# EAGLE schematic reclone-rise (EAGLE 7.6.0)

## Sheet 1 of 2: MCU, Power, uSD, USB, JTAG, Serial, RTC
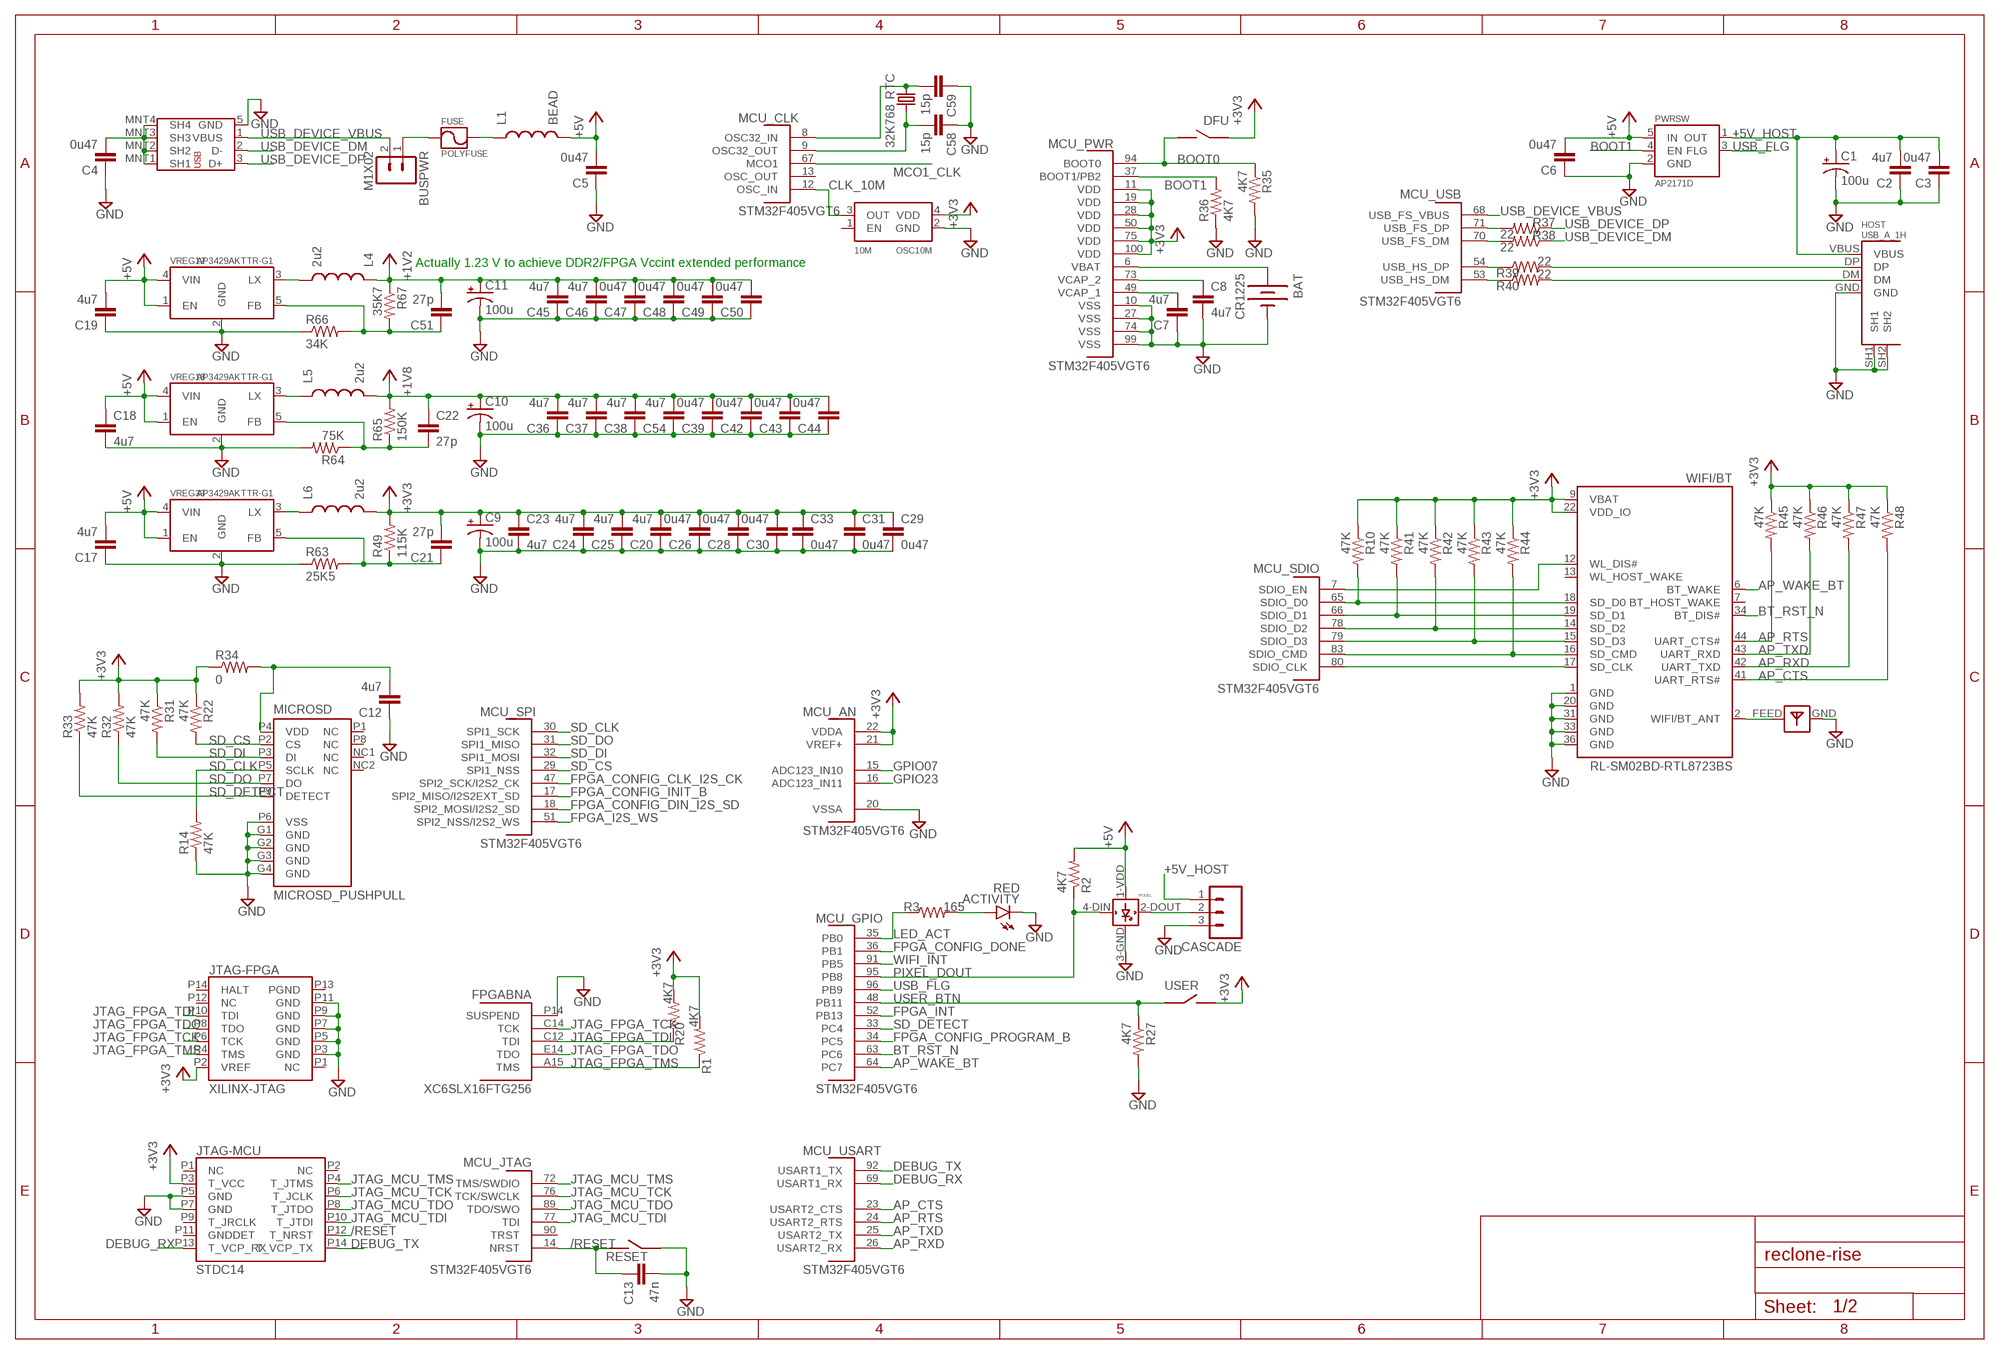
[diagram p0: schematic, sheet 1]

### Parts
ACTIVITY  RED  LED0603  [LED-0603]
ANTENNA  ANTENNA_MEANDER_2.4GHZ  [MEANDER_ANTENNA_2.4GHZ]
BAT  CR1225  BATTERY12MM  [BATTCON_12MM]
BUSPWR  M1X02  [1X2-RTANG]
C1  100u  CAP_POL1206  [EIA3216]
C2  4u7  CAP0603-CAP  [0603-CAP]
C3  0u47  CAP0603-CAP  [0603-CAP]
C4  0u47  CAP0603-CAP  [0603-CAP]
C5  0u47  CAP0603-CAP  [0603-CAP]
C6  0u47  CAP0603-CAP  [0603-CAP]
C7  4u7  CAP0603-CAP  [0603-CAP]
C8  4u7  CAP0603-CAP  [0603-CAP]
C9  100u  CAP_POL1206  [EIA3216]
C10  100u  CAP_POL1206  [EIA3216]
C11  100u  CAP_POL1206  [EIA3216]
C12  4u7  CAP0603-CAP  [0603-CAP]
C13  47n  CAP0603-CAP  [0603-CAP]
C17  4u7  CAP0603-CAP  [0603-CAP]
C18  4u7  CAP0603-CAP  [0603-CAP]
C19  4u7  CAP0603-CAP  [0603-CAP]
C20  4u7  CAP0603-CAP  [0603-CAP]
C21  27p  CAP0603-CAP  [0603-CAP]
C22  27p  CAP0603-CAP  [0603-CAP]
C23  4u7  CAP0603-CAP  [0603-CAP]
C24  4u7  CAP0603-CAP  [0603-CAP]
C25  4u7  CAP0603-CAP  [0603-CAP]
C26  0u47  CAP0603-CAP  [0603-CAP]
C28  0u47  CAP0603-CAP  [0603-CAP]
C29  0u47  CAP0603-CAP  [0603-CAP]
C30  0u47  CAP0603-CAP  [0603-CAP]
C31  0u47  CAP0603-CAP  [0603-CAP]
C33  0u47  CAP0603-CAP  [0603-CAP]
C36  4u7  CAP0603-CAP  [0603-CAP]
C37  4u7  CAP0603-CAP  [0603-CAP]
C38  4u7  CAP0603-CAP  [0603-CAP]
C39  0u47  CAP0603-CAP  [0603-CAP]
C42  0u47  CAP0603-CAP  [0603-CAP]
C43  0u47  CAP0603-CAP  [0603-CAP]
C44  0u47  CAP0603-CAP  [0603-CAP]
C45  4u7  CAP0603-CAP  [0603-CAP]
C46  4u7  CAP0603-CAP  [0603-CAP]
C47  0u47  CAP0603-CAP  [0603-CAP]
C48  0u47  CAP0603-CAP  [0603-CAP]
C49  0u47  CAP0603-CAP  [0603-CAP]
C50  0u47  CAP0603-CAP  [0603-CAP]
C51  27p  CAP0603-CAP  [0603-CAP]
C54  4u7  CAP0603-CAP  [0603-CAP]
C58  15p  CAP0603-CAP  [0603-CAP]
C59  15p  CAP0603-CAP  [0603-CAP]
CASCADE  M03PTH  [1X03]
DEVICE  USB-MICRO-B-SMD  [USB-MICRO-B-SMD]
DFU  PTS636  [PB_TACT_PTH_6X3.5]
FPGA  XC6SLX16FTG256  [FT256]
FUSE  POLYFUSE  [1206L]
HOST  USB_A_1H  [USB-A-1H]
JTAG-FPGA  XILINX-JTAG  [XILINX-JTAG]
JTAG-MCU  STDC14  [PTH_14_1.27]
L1  BEAD  INDUCTOR0603  [0603]
L4  2u2  INDUCTOR0805  [0805]
L5  2u2  INDUCTOR0805  [0805]
L6  2u2  INDUCTOR0805  [0805]
MCU  STM32F405VGT6  [LQFP-100]
MICROSD  MICROSD_PUSHPULL  [MICROSD_PUSHPULL]
OSC10M  10M  OSC_ENABLED_SMD  [OSC-5X3.2]
PIXEL  WS2812B  [WS2812B]
PWRSW  AP2171D  [SOT25]
R1  4K7  RESISTOR0603-RES  [0603-RES]
R2  4K7  RESISTOR0603-RES  [0603-RES]
R3  165  RESISTOR0603-RES  [0603-RES]
R10  47K  RESISTOR0603-RES  [0603-RES]
R14  47K  RESISTOR0603-RES  [0603-RES]
R20  4K7  RESISTOR0603-RES  [0603-RES]
R22  47K  RESISTOR0603-RES  [0603-RES]
R27  4K7  RESISTOR0603-RES  [0603-RES]
R31  47K  RESISTOR0603-RES  [0603-RES]
R32  47K  RESISTOR0603-RES  [0603-RES]
R33  47K  RESISTOR0603-RES  [0603-RES]
R34  0  RESISTOR0603-RES  [0603-RES]
R35  4K7  RESISTOR0603-RES  [0603-RES]
R36  4K7  RESISTOR0603-RES  [0603-RES]
R37  22  RESISTOR0603-RES  [0603-RES]
R38  22  RESISTOR0603-RES  [0603-RES]
R39  22  RESISTOR0603-RES  [0603-RES]
R40  22  RESISTOR0603-RES  [0603-RES]
R41  47K  RESISTOR0603-RES  [0603-RES]
R42  47K  RESISTOR0603-RES  [0603-RES]
R43  47K  RESISTOR0603-RES  [0603-RES]
R44  47K  RESISTOR0603-RES  [0603-RES]
R45  47K  RESISTOR0603-RES  [0603-RES]
R46  47K  RESISTOR0603-RES  [0603-RES]
R47  47K  RESISTOR0603-RES  [0603-RES]
R48  47K  RESISTOR0603-RES  [0603-RES]
R49  115K  RESISTOR0603-RES  [0603-RES]
R63  25K5  RESISTOR0603-RES  [0603-RES]
R64  75K  RESISTOR0603-RES  [0603-RES]
R65  150K  RESISTOR0603-RES  [0603-RES]
R66  34K  RESISTOR0603-RES  [0603-RES]
R67  35K7  RESISTOR0603-RES  [0603-RES]
RESET  PTS636  [PB_TACT_PTH_6X3.5]
RTC  32K768  CRYSTAL  [CRYSTAL-32KHZ-SMD]
USER  SPST_TACT_6X6  [PB_TACT_PTH_6X6]
VREG12  AP3429AKTTR-G1  AP3429A  [SOT-23-5]
VREG18  AP3429AKTTR-G1  AP3429A  [SOT-23-5]
VREG33  AP3429AKTTR-G1  AP3429A  [SOT-23-5]
WIFI/BT  RL-SM02BD-RTL8723BS  [LGA12-44]

### Nets
+1V2: C11.A(+) C45.2 C46.2 C47.2 C48.2 C49.2 C50.2 C51.2 L4.1 R67.1 ; also sheet 2
+1V8: C10.A(+) C22.1 C36.2 C37.2 C38.2 C39.2 C42.2 C43.2 C44.2 C54.2 L5.2 R65.2 ; also sheet 2
+3V3: C9.A(+) C20.2 C21.2 C23.1 C24.2 C25.2 C26.2 C28.2 C29.1 C30.2 C31.1 C33.1 DFU.1(A) JTAG-FPGA.P2(VREF) JTAG-MCU.P3(T_VCC) L6.2 MCU.11(_PWR:VDD) MCU.19(_PWR:VDD) MCU.21(_AN:VREF+) MCU.22(_AN:VDDA) MCU.28(_PWR:VDD) MCU.50(_PWR:VDD) MCU.75(_PWR:VDD) MCU.100(_PWR:VDD) OSC10M.4(VDD) R1.2 R10.1 R20.2 R22.1 R31.1 R32.2 R33.2 R34.1 R41.1 R42.1 R43.1 R44.1 R45.1 R46.1 R47.1 R48.1 R49.2 USER.3(B) WIFI/BT.9(VBAT) WIFI/BT.22(VDD_IO) ; also sheet 2
+3V3_SD: C12.2 MICROSD.P4(VDD) R34.2
+5V: C5.2 C6.2 C17.2 C18.1 C19.2 L1.2 PIXEL.1-VDD(VDD) PWRSW.5(IN) R2.2 VREG12.1(EN) VREG12.4(VIN) VREG18.1(EN) VREG18.4(VIN) VREG33.1(EN) VREG33.4(VIN) ; also sheet 2
+5V_HOST: C1.A(+) C2.2 C3.2 CASCADE.1 HOST.VBUS PWRSW.1(OUT)
/RESET: C13.1 JTAG-MCU.P12(T_NRST) MCU.14(_JTAG:NRST) RESET.2(B)
ANTENNA: ANTENNA.FEED WIFI/BT.2(WIFI/BT_ANT)
AP_CTS: MCU.23(_USART:USART2_CTS) R48.2 WIFI/BT.41(UART_RTS#)
AP_RTS: MCU.24(_USART:USART2_RTS) R45.2 WIFI/BT.44(UART_CTS#)
AP_RXD: MCU.26(_USART:USART2_RX) R47.2 WIFI/BT.42(UART_TXD)
AP_TXD: MCU.25(_USART:USART2_TX) R46.2 WIFI/BT.43(UART_RXD)
AP_WAKE_BT: MCU.64(_GPIO:PC7) WIFI/BT.6(BT_WAKE)
BOOT0: DFU.2(B) MCU.94(_PWR:BOOT0) R35.1
BOOT1: MCU.37(_PWR:BOOT1/PB2) PWRSW.4(EN) R36.2
BT_RST_N: MCU.63(_GPIO:PC6) WIFI/BT.34(BT_DIS#)
CASCADE_DOUT: CASCADE.2 PIXEL.2-DOUT(DOUT)
CLK_10M: MCU.12(_CLK:OSC_IN) OSC10M.3(OUT) ; also sheet 2
DEBUG_RX: JTAG-MCU.P13(T_VCP_RX) MCU.69(_USART:USART1_RX)
DEBUG_TX: JTAG-MCU.P14(T_VCP_TX) MCU.92(_USART:USART1_TX)
DM2: HOST.DM R40.2
DP2: HOST.DP R39.2
FPGA_CONFIG_CLK_I2S_CK: MCU.47(_SPI:SPI2_SCK/I2S2_CK) ; also sheet 2
FPGA_CONFIG_DIN_I2S_SD: MCU.18(_SPI:SPI2_MOSI/I2S2_SD) ; also sheet 2
FPGA_CONFIG_DONE: MCU.36(_GPIO:PB1) ; also sheet 2
FPGA_CONFIG_INIT_B: MCU.17(_SPI:SPI2_MISO/I2S2EXT_SD) ; also sheet 2
FPGA_CONFIG_PROGRAM_B: MCU.34(_GPIO:PC5) ; also sheet 2
FPGA_I2S_WS: MCU.51(_SPI:SPI2_NSS/I2S2_WS) ; also sheet 2
FPGA_INT: MCU.52(_GPIO:PB13) ; also sheet 2
GND: ACTIVITY.C ANTENNA.GND BAT.GND(-) C1.C(-) C2.1 C3.1 C4.1 C5.1 C6.1 C7.1 C8.2 C9.C(-) C10.C(-) C11.C(-) C12.1 C13.2 C17.1 C18.2 C19.1 C20.1 C23.2 C24.1 C25.1 C26.1 C28.1 C29.2 C30.1 C31.2 C33.2 C36.1 C37.1 C38.1 C39.1 C42.1 C43.1 C44.1 C45.1 C46.1 C47.1 C48.1 C49.1 C50.1 C54.1 C58.1 C59.1 CASCADE.3 DEVICE.5(GND) FPGA.P14(BNA:SUSPEND) HOST.GND HOST.SH1 HOST.SH2 JTAG-FPGA.P3(GND) JTAG-FPGA.P5(GND) JTAG-FPGA.P7(GND) JTAG-FPGA.P9(GND) JTAG-FPGA.P11(GND) JTAG-MCU.P5(GND) JTAG-MCU.P7(GND) MCU.10(_PWR:VSS) MCU.20(_AN:VSSA) MCU.27(_PWR:VSS) MCU.74(_PWR:VSS) MCU.99(_PWR:VSS) MICROSD.G1(GND) MICROSD.G2(GND) MICROSD.G3(GND) MICROSD.G4(GND) MICROSD.P6(VSS) OSC10M.2(GND) PIXEL.3-GND(GND) PWRSW.2(GND) R14.1 R27.2 R35.2 R36.1 R63.1 R64.2 R66.1 RESET.1(A) VREG12.2(GND) VREG18.2(GND) VREG33.2(GND) WIFI/BT.1(GND) WIFI/BT.20(GND) WIFI/BT.31(GND) WIFI/BT.33(GND) WIFI/BT.36(GND) ; also sheet 2
GPIO07: MCU.15(_AN:ADC123_IN10) ; also sheet 2
GPIO23: MCU.16(_AN:ADC123_IN11) ; also sheet 2
JTAG_FPGA_TCK: FPGA.C14(BNA:TCK) JTAG-FPGA.P6(TCK)
JTAG_FPGA_TDI: FPGA.C12(BNA:TDI) JTAG-FPGA.P10(TDI) R20.1
JTAG_FPGA_TDO: FPGA.E14(BNA:TDO) JTAG-FPGA.P8(TDO)
JTAG_FPGA_TMS: FPGA.A15(BNA:TMS) JTAG-FPGA.P4(TMS) R1.1
JTAG_MCU_TCK: JTAG-MCU.P6(T_JCLK) MCU.76(_JTAG:TCK/SWCLK)
JTAG_MCU_TDI: JTAG-MCU.P10(T_JTDI) MCU.77(_JTAG:TDI)
JTAG_MCU_TDO: JTAG-MCU.P8(T_JTDO) MCU.89(_JTAG:TDO/SWO)
JTAG_MCU_TMS: JTAG-MCU.P4(T_JTMS) MCU.72(_JTAG:TMS/SWDIO)
LED_ACT: MCU.35(_GPIO:PB0) R3.1
MCO1_CLK: MCU.67(_CLK:MCO1) ; also sheet 2
N$1: MCU.71(_USB:USB_FS_DP) R37.2
N$2: MCU.70(_USB:USB_FS_DM) R38.2
N$3: MCU.54(_USB:USB_HS_DP) R39.1
N$4: MCU.53(_USB:USB_HS_DM) R40.1
N$5: L4.2 VREG12.3(LX)
N$8: C4.2 DEVICE.MNT1(SH1) DEVICE.MNT2(SH2) DEVICE.MNT3(SH3) DEVICE.MNT4(SH4)
N$14: C22.2 R64.1 R65.1 VREG18.5(FB)
N$15: C51.1 R66.2 R67.2 VREG12.5(FB)
N$24: C21.1 R49.1 R63.2 VREG33.5(FB)
N$40: C58.2 MCU.9(_CLK:OSC32_OUT) RTC.4
N$48: C59.2 MCU.8(_CLK:OSC32_IN) RTC.1
N$59: BUSPWR.1 FUSE.1
N$60: ACTIVITY.A R3.2
N$76: FUSE.2 L1.1
N$120: L5.1 VREG18.3(LX)
N$121: L6.1 VREG33.3(LX)
PIXEL_DOUT: MCU.95(_GPIO:PB8) PIXEL.4-DIN(DIN) R2.1
SD_CLK: MCU.30(_SPI:SPI1_SCK) MICROSD.P5(SCLK) R14.2
SD_CS: MCU.29(_SPI:SPI1_NSS) MICROSD.P2(CS) R22.2
SD_DETECT: MCU.33(_GPIO:PC4) MICROSD.P9(DETECT) R33.1
SD_DI: MCU.32(_SPI:SPI1_MOSI) MICROSD.P3(DI) R31.2
SD_DO: MCU.31(_SPI:SPI1_MISO) MICROSD.P7(DO) R32.1
SDIO_CLK: MCU.80(_SDIO:SDIO_CLK) WIFI/BT.17(SD_CLK)
SDIO_CMD: MCU.83(_SDIO:SDIO_CMD) R44.2 WIFI/BT.16(SD_CMD)
SDIO_D0: MCU.65(_SDIO:SDIO_D0) R10.2 WIFI/BT.18(SD_D0)
SDIO_D1: MCU.66(_SDIO:SDIO_D1) R41.2 WIFI/BT.19(SD_D1)
SDIO_D2: MCU.78(_SDIO:SDIO_D2) R42.2 WIFI/BT.14(SD_D2)
SDIO_D3: MCU.79(_SDIO:SDIO_D3) R43.2 WIFI/BT.15(SD_D3)
SDIO_EN: MCU.7(_SDIO:SDIO_EN) WIFI/BT.12(WL_DIS#)
USB_DEVICE_DM: DEVICE.2(D-) R38.1
USB_DEVICE_DP: DEVICE.3(D+) R37.1
USB_DEVICE_VBUS: BUSPWR.2 DEVICE.1(VBUS) MCU.68(_USB:USB_FS_VBUS)
USB_FLG: MCU.96(_GPIO:PB9) PWRSW.3(FLG)
USER_BTN: MCU.48(_GPIO:PB11) R27.1 USER.1(A)
VBAT: BAT.PWR@1(+) MCU.6(_PWR:VBAT)
VCAP_1: C7.2 MCU.49(_PWR:VCAP_1)
VCAP_2: C8.1 MCU.73(_PWR:VCAP_2)
WIFI_INT: MCU.91(_GPIO:PB5)
Unconnected: JTAG-FPGA.P1(NC) JTAG-FPGA.P12(NC) JTAG-FPGA.P13(PGND) JTAG-FPGA.P14(HALT) JTAG-MCU.P1(NC) JTAG-MCU.P2(NC) JTAG-MCU.P9(T_JRCLK) JTAG-MCU.P11(GNDDET) MCU.13(_CLK:OSC_OUT) MCU.90(_JTAG:TRST) MICROSD.NC1(NC) MICROSD.NC2(NC) MICROSD.P1(NC) MICROSD.P8(NC) OSC10M.1(EN) WIFI/BT.7(BT_HOST_WAKE) WIFI/BT.13(WL_HOST_WAKE)

### Notes on the sheet
- Actually 1.23 V to achieve DDR2/FPGA Vccint extended performance

## Sheet 2 of 2: FPGA, GPIO, DDR2, Audio, Video
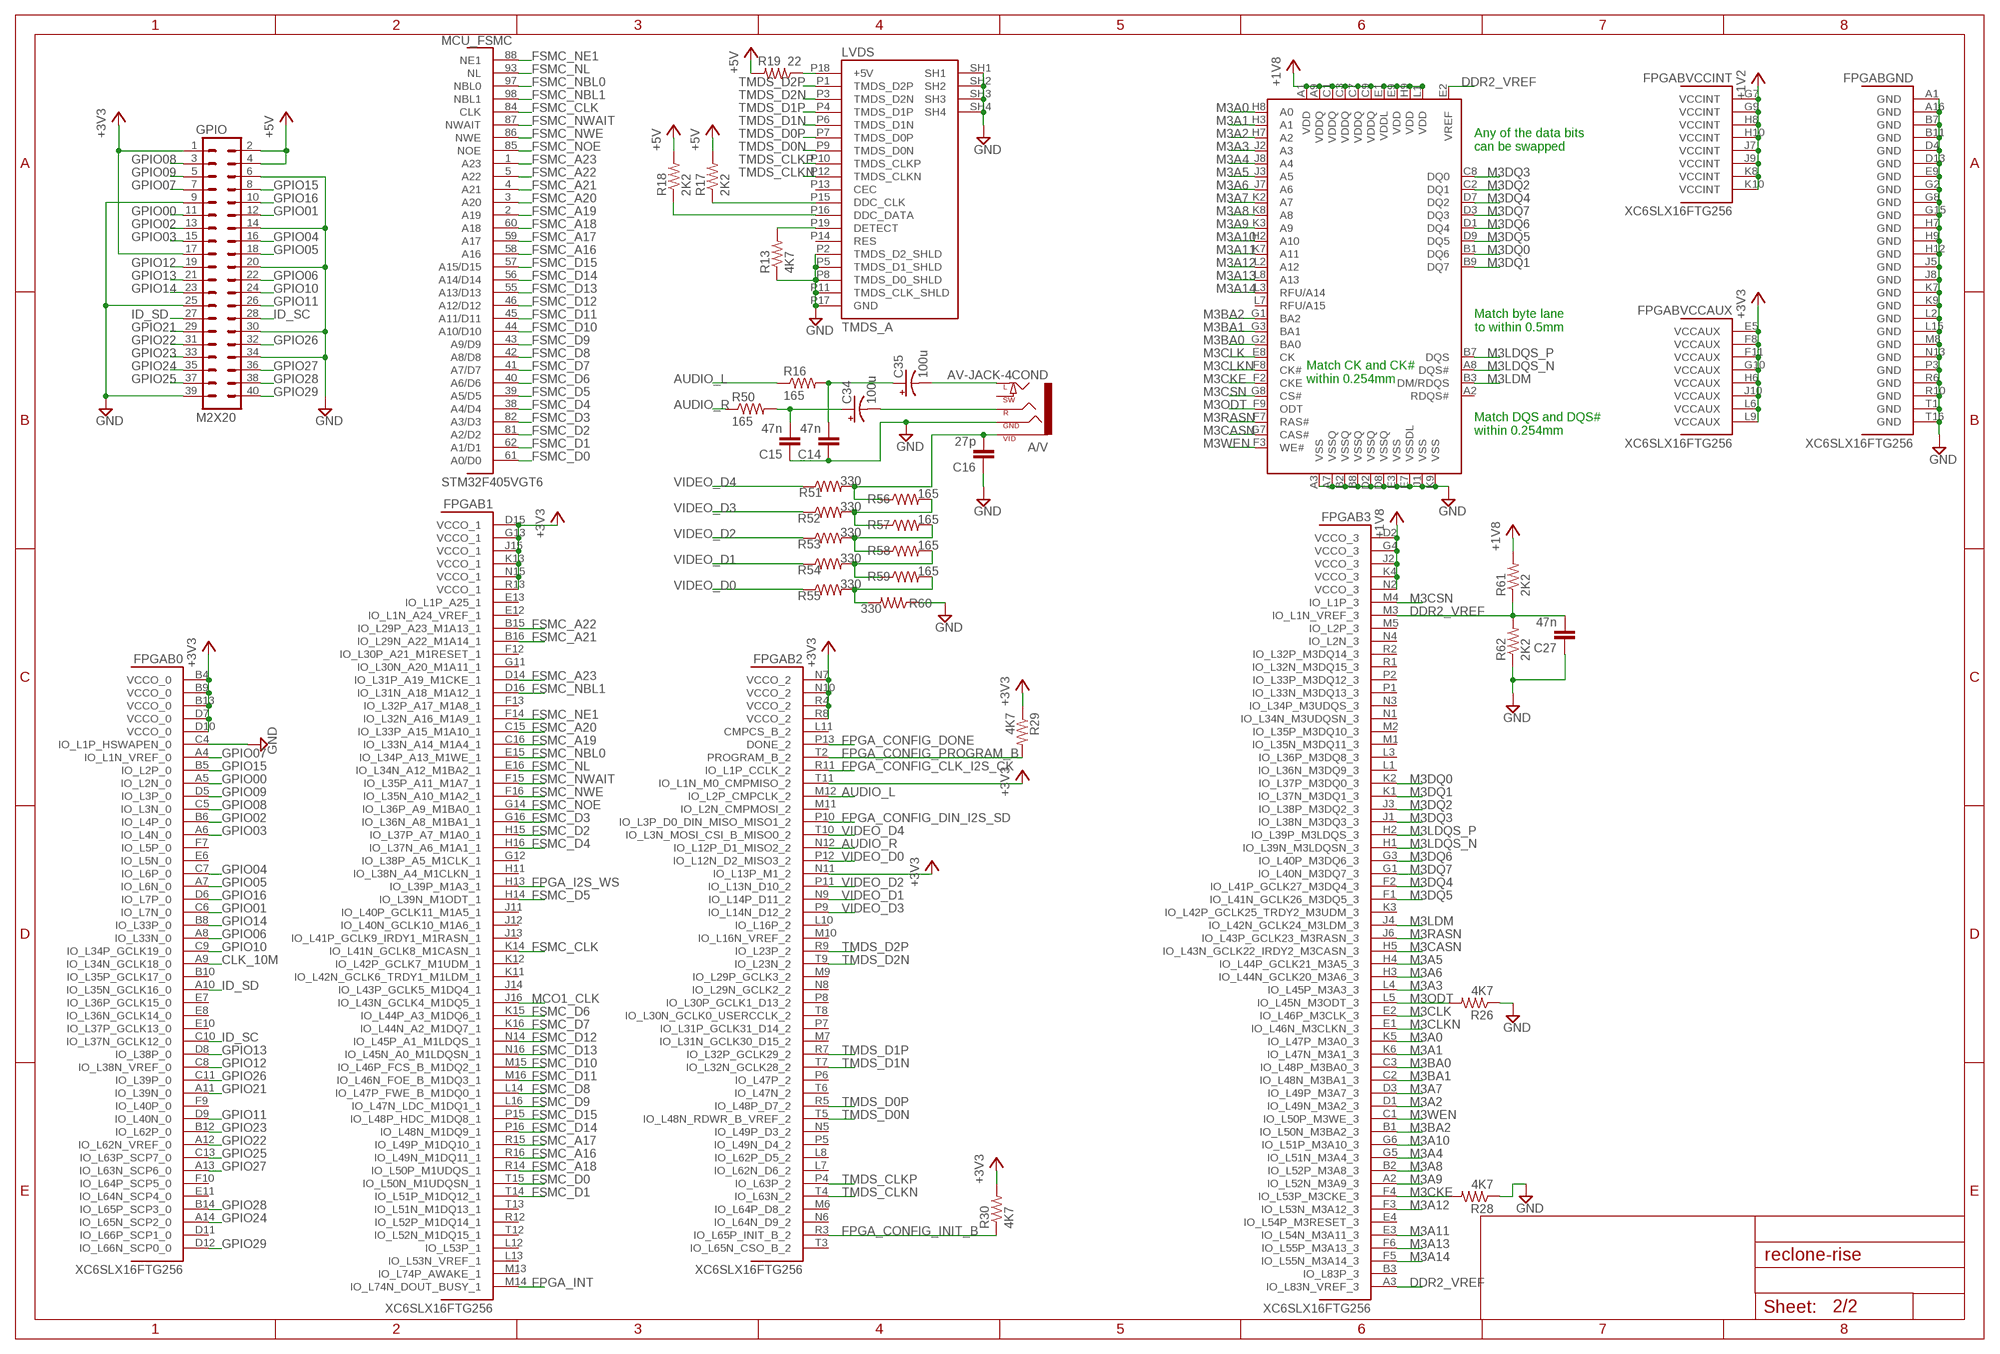
[diagram p1: schematic, sheet 2]

### Parts
A/V  AV-JACK-4COND  [AV-JACK-3.5MM-4COND-SMD]
C14  47n  CAP0603-CAP  [0603-CAP]
C15  47n  CAP0603-CAP  [0603-CAP]
C16  27p  CAP0603-CAP  [0603-CAP]
C27  47n  CAP0603-CAP  [0603-CAP]
C34  100u  CAP_POL1206  [EIA3216]
C35  100u  CAP_POL1206  [EIA3216]
GPIO  M2X20  [2X20]
LVDS  TMDS_A  [TMDS_A_SMT]
R13  4K7  RESISTOR0603-RES  [0603-RES]
R16  165  RESISTOR0603-RES  [0603-RES]
R17  2K2  RESISTOR0603-RES  [0603-RES]
R18  2K2  RESISTOR0603-RES  [0603-RES]
R19  22  RESISTOR0603-RES  [0603-RES]
R26  4K7  RESISTOR0603-RES  [0603-RES]
R28  4K7  RESISTOR0603-RES  [0603-RES]
R29  4K7  RESISTOR0603-RES  [0603-RES]
R30  4K7  RESISTOR0603-RES  [0603-RES]
R50  165  RESISTOR0603-RES  [0603-RES]
R51  330  RESISTOR0603-RES  [0603-RES]
R52  330  RESISTOR0603-RES  [0603-RES]
R53  330  RESISTOR0603-RES  [0603-RES]
R54  330  RESISTOR0603-RES  [0603-RES]
R55  330  RESISTOR0603-RES  [0603-RES]
R56  165  RESISTOR0603-RES  [0603-RES]
R57  165  RESISTOR0603-RES  [0603-RES]
R58  165  RESISTOR0603-RES  [0603-RES]
R59  165  RESISTOR0603-RES  [0603-RES]
R60  330  RESISTOR0603-RES  [0603-RES]
R61  2K2  RESISTOR0603-RES  [0603-RES]
R62  2K2  RESISTOR0603-RES  [0603-RES]
RAM  DDR2_X8  [60-FBGA-9X11.5]

### Nets
+1V2: FPGA.G7(BVCCINT:VCCINT) FPGA.G9(BVCCINT:VCCINT) FPGA.H8(BVCCINT:VCCINT) FPGA.H10(BVCCINT:VCCINT) FPGA.J7(BVCCINT:VCCINT) FPGA.J9(BVCCINT:VCCINT) FPGA.K8(BVCCINT:VCCINT) FPGA.K10(BVCCINT:VCCINT) ; also sheet 1
+1V8: FPGA.D2(B3:VCCO_3) FPGA.G4(B3:VCCO_3) FPGA.J2(B3:VCCO_3) FPGA.K4(B3:VCCO_3) FPGA.N2(B3:VCCO_3) R61.2 RAM.A1(VDD) RAM.A9(VDDQ) RAM.C1(VDDQ) RAM.C3(VDDQ) RAM.C7(VDDQ) RAM.C9(VDDQ) RAM.E1(VDDL) RAM.E9(VDD) RAM.H9(VDD) RAM.L1(VDD) ; also sheet 1
+3V3: FPGA.B4(B0:VCCO_0) FPGA.B9(B0:VCCO_0) FPGA.B13(B0:VCCO_0) FPGA.D7(B0:VCCO_0) FPGA.D10(B0:VCCO_0) FPGA.D15(B1:VCCO_1) FPGA.E5(BVCCAUX:VCCAUX) FPGA.F8(BVCCAUX:VCCAUX) FPGA.F11(BVCCAUX:VCCAUX) FPGA.G10(BVCCAUX:VCCAUX) FPGA.G13(B1:VCCO_1) FPGA.H6(BVCCAUX:VCCAUX) FPGA.J10(BVCCAUX:VCCAUX) FPGA.J15(B1:VCCO_1) FPGA.K13(B1:VCCO_1) FPGA.L6(BVCCAUX:VCCAUX) FPGA.L9(BVCCAUX:VCCAUX) FPGA.N7(B2:VCCO_2) FPGA.N10(B2:VCCO_2) FPGA.N11(B2:IO_L13P_M1_2) FPGA.N15(B1:VCCO_1) FPGA.R4(B2:VCCO_2) FPGA.R8(B2:VCCO_2) FPGA.R13(B1:VCCO_1) FPGA.T11(B2:IO_L1N_M0_CMPMISO_2) GPIO.1 GPIO.17 R29.1 R30.2 ; also sheet 1
+5V: GPIO.2 GPIO.4 R17.2 R18.2 R19.2 ; also sheet 1
AUDIO_L: FPGA.M12(B2:IO_L2P_CMPCLK_2) R16.1
AUDIO_R: FPGA.N12(B2:IO_L12P_D1_MISO2_2) R50.1
CLK_10M: FPGA.A9(B0:IO_L34N_GCLK18_0) ; also sheet 1
DDR2_VREF: C27.2 FPGA.A3(B3:IO_L83N_VREF_3) FPGA.M3(B3:IO_L1N_VREF_3) R61.1 R62.2 RAM.E2(VREF)
FPGA_CONFIG_CLK_I2S_CK: FPGA.R11(B2:IO_L1P_CCLK_2) ; also sheet 1
FPGA_CONFIG_DIN_I2S_SD: FPGA.P10(B2:IO_L3P_D0_DIN_MISO_MISO1_2) ; also sheet 1
FPGA_CONFIG_DONE: FPGA.P13(B2:DONE_2) ; also sheet 1
FPGA_CONFIG_INIT_B: FPGA.R3(B2:IO_L65P_INIT_B_2) R30.1 ; also sheet 1
FPGA_CONFIG_PROGRAM_B: FPGA.T2(B2:PROGRAM_B_2) R29.2 ; also sheet 1
FPGA_I2S_WS: FPGA.H13(B1:IO_L39P_M1A3_1) ; also sheet 1
FPGA_INT: FPGA.M14(B1:IO_L74N_DOUT_BUSY_1) ; also sheet 1
FSMC_A16: FPGA.R16(B1:IO_L49N_M1DQ11_1) MCU.58(_FSMC:A16)
FSMC_A17: FPGA.R15(B1:IO_L49P_M1DQ10_1) MCU.59(_FSMC:A17)
FSMC_A18: FPGA.R14(B1:IO_L50P_M1UDQS_1) MCU.60(_FSMC:A18)
FSMC_A19: FPGA.C16(B1:IO_L33N_A14_M1A4_1) MCU.2(_FSMC:A19)
FSMC_A20: FPGA.C15(B1:IO_L33P_A15_M1A10_1) MCU.3(_FSMC:A20)
FSMC_A21: FPGA.B16(B1:IO_L29N_A22_M1A14_1) MCU.4(_FSMC:A21)
FSMC_A22: FPGA.B15(B1:IO_L29P_A23_M1A13_1) MCU.5(_FSMC:A22)
FSMC_A23: FPGA.D14(B1:IO_L31P_A19_M1CKE_1) MCU.1(_FSMC:A23)
FSMC_CLK: FPGA.K14(B1:IO_L41N_GCLK8_M1CASN_1) MCU.84(_FSMC:CLK)
FSMC_D0: FPGA.T15(B1:IO_L50N_M1UDQSN_1) MCU.61(_FSMC:A0/D0)
FSMC_D1: FPGA.T14(B1:IO_L51P_M1DQ12_1) MCU.62(_FSMC:A1/D1)
FSMC_D2: FPGA.H15(B1:IO_L37P_A7_M1A0_1) MCU.81(_FSMC:A2/D2)
FSMC_D3: FPGA.G16(B1:IO_L36N_A8_M1BA1_1) MCU.82(_FSMC:A3/D3)
FSMC_D4: FPGA.H16(B1:IO_L37N_A6_M1A1_1) MCU.38(_FSMC:A4/D4)
FSMC_D5: FPGA.H14(B1:IO_L39N_M1ODT_1) MCU.39(_FSMC:A5/D5)
FSMC_D6: FPGA.K15(B1:IO_L44P_A3_M1DQ6_1) MCU.40(_FSMC:A6/D6)
FSMC_D7: FPGA.K16(B1:IO_L44N_A2_M1DQ7_1) MCU.41(_FSMC:A7/D7)
FSMC_D8: FPGA.L14(B1:IO_L47P_FWE_B_M1DQ0_1) MCU.42(_FSMC:A8/D8)
FSMC_D9: FPGA.L16(B1:IO_L47N_LDC_M1DQ1_1) MCU.43(_FSMC:A9/D9)
FSMC_D10: FPGA.M15(B1:IO_L46P_FCS_B_M1DQ2_1) MCU.44(_FSMC:A10/D10)
FSMC_D11: FPGA.M16(B1:IO_L46N_FOE_B_M1DQ3_1) MCU.45(_FSMC:A11/D11)
FSMC_D12: FPGA.N14(B1:IO_L45P_A1_M1LDQS_1) MCU.46(_FSMC:A12/D12)
FSMC_D13: FPGA.N16(B1:IO_L45N_A0_M1LDQSN_1) MCU.55(_FSMC:A13/D13)
FSMC_D14: FPGA.P16(B1:IO_L48N_M1DQ9_1) MCU.56(_FSMC:A14/D14)
FSMC_D15: FPGA.P15(B1:IO_L48P_HDC_M1DQ8_1) MCU.57(_FSMC:A15/D15)
FSMC_NBL0: FPGA.E15(B1:IO_L34P_A13_M1WE_1) MCU.97(_FSMC:NBL0)
FSMC_NBL1: FPGA.D16(B1:IO_L31N_A18_M1A12_1) MCU.98(_FSMC:NBL1)
FSMC_NE1: FPGA.F14(B1:IO_L32N_A16_M1A9_1) MCU.88(_FSMC:NE1)
FSMC_NL: FPGA.E16(B1:IO_L34N_A12_M1BA2_1) MCU.93(_FSMC:NL)
FSMC_NOE: FPGA.G14(B1:IO_L36P_A9_M1BA0_1) MCU.85(_FSMC:NOE)
FSMC_NWAIT: FPGA.F15(B1:IO_L35P_A11_M1A7_1) MCU.87(_FSMC:NWAIT)
FSMC_NWE: FPGA.F16(B1:IO_L35N_A10_M1A2_1) MCU.86(_FSMC:NWE)
GND: A/V.RING2(GND) C14.1 C15.1 C16.1 C27.1 FPGA.A1(BGND:GND) FPGA.A16(BGND:GND) FPGA.B7(BGND:GND) FPGA.B11(BGND:GND) FPGA.C4(B0:IO_L1P_HSWAPEN_0) FPGA.D4(BGND:GND) FPGA.D13(BGND:GND) FPGA.E9(BGND:GND) FPGA.G2(BGND:GND) FPGA.G8(BGND:GND) FPGA.G15(BGND:GND) FPGA.H7(BGND:GND) FPGA.H9(BGND:GND) FPGA.H12(BGND:GND) FPGA.J5(BGND:GND) FPGA.J8(BGND:GND) FPGA.K7(BGND:GND) FPGA.K9(BGND:GND) FPGA.L2(BGND:GND) FPGA.L15(BGND:GND) FPGA.M8(BGND:GND) FPGA.N13(BGND:GND) FPGA.P3(BGND:GND) FPGA.R6(BGND:GND) FPGA.R10(BGND:GND) FPGA.T1(BGND:GND) FPGA.T16(BGND:GND) GPIO.6 GPIO.9 GPIO.14 GPIO.20 GPIO.25 GPIO.30 GPIO.34 GPIO.39 LVDS.P2(TMDS_D2_SHLD) LVDS.P5(TMDS_D1_SHLD) LVDS.P8(TMDS_D0_SHLD) LVDS.P11(TMDS_CLK_SHLD) LVDS.P17(GND) LVDS.SH1 LVDS.SH2 LVDS.SH3 LVDS.SH4 R13.1 R26.1 R28.1 R60.1 R62.1 RAM.A3(VSS) RAM.A7(VSSQ) RAM.B2(VSSQ) RAM.B8(VSSQ) RAM.D2(VSSQ) RAM.D8(VSSQ) RAM.E3(VSS) RAM.E7(VSSDL) RAM.J1(VSS) RAM.K9(VSS) ; also sheet 1
GPIO00: FPGA.A5(B0:IO_L2N_0) GPIO.11
GPIO01: FPGA.C6(B0:IO_L7N_0) GPIO.12
GPIO02: FPGA.B6(B0:IO_L4P_0) GPIO.13
GPIO03: FPGA.A6(B0:IO_L4N_0) GPIO.15
GPIO04: FPGA.C7(B0:IO_L6P_0) GPIO.16
GPIO05: FPGA.A7(B0:IO_L6N_0) GPIO.18
GPIO06: FPGA.A8(B0:IO_L33N_0) GPIO.22
GPIO07: FPGA.A4(B0:IO_L1N_VREF_0) GPIO.7 ; also sheet 1
GPIO08: FPGA.C5(B0:IO_L3N_0) GPIO.3
GPIO09: FPGA.D5(B0:IO_L3P_0) GPIO.5
GPIO10: FPGA.C9(B0:IO_L34P_GCLK19_0) GPIO.24
GPIO11: FPGA.D9(B0:IO_L40N_0) GPIO.26
GPIO12: FPGA.C8(B0:IO_L38N_VREF_0) GPIO.19
GPIO13: FPGA.D8(B0:IO_L38P_0) GPIO.21
GPIO14: FPGA.B8(B0:IO_L33P_0) GPIO.23
GPIO15: FPGA.B5(B0:IO_L2P_0) GPIO.8
GPIO16: FPGA.D6(B0:IO_L7P_0) GPIO.10
GPIO21: FPGA.A11(B0:IO_L39N_0) GPIO.29
GPIO22: FPGA.A12(B0:IO_L62N_VREF_0) GPIO.31
GPIO23: FPGA.B12(B0:IO_L62P_0) GPIO.33 ; also sheet 1
GPIO24: FPGA.A14(B0:IO_L65N_SCP2_0) GPIO.35
GPIO25: FPGA.C13(B0:IO_L63P_SCP7_0) GPIO.37
GPIO26: FPGA.C11(B0:IO_L39P_0) GPIO.32
GPIO27: FPGA.A13(B0:IO_L63N_SCP6_0) GPIO.36
GPIO28: FPGA.B14(B0:IO_L65P_SCP3_0) GPIO.38
GPIO29: FPGA.D12(B0:IO_L66N_SCP0_0) GPIO.40
ID_SC: FPGA.C10(B0:IO_L37N_GCLK12_0) GPIO.28
ID_SD: FPGA.A10(B0:IO_L35N_GCLK16_0) GPIO.27
M3A0: FPGA.K5(B3:IO_L47P_M3A0_3) RAM.H8(A0)
M3A1: FPGA.K6(B3:IO_L47N_M3A1_3) RAM.H3(A1)
M3A2: FPGA.D1(B3:IO_L49N_M3A2_3) RAM.H7(A2)
M3A3: FPGA.L4(B3:IO_L45P_M3A3_3) RAM.J2(A3)
M3A4: FPGA.G5(B3:IO_L51N_M3A4_3) RAM.J8(A4)
M3A5: FPGA.H4(B3:IO_L44P_GCLK21_M3A5_3) RAM.J3(A5)
M3A6: FPGA.H3(B3:IO_L44N_GCLK20_M3A6_3) RAM.J7(A6)
M3A7: FPGA.D3(B3:IO_L49P_M3A7_3) RAM.K2(A7)
M3A8: FPGA.B2(B3:IO_L52P_M3A8_3) RAM.K8(A8)
M3A9: FPGA.A2(B3:IO_L52N_M3A9_3) RAM.K3(A9)
M3A10: FPGA.G6(B3:IO_L51P_M3A10_3) RAM.H2(A10)
M3A11: FPGA.E3(B3:IO_L54N_M3A11_3) RAM.K7(A11)
M3A12: FPGA.F3(B3:IO_L53N_M3A12_3) RAM.L2(A12)
M3A13: FPGA.F6(B3:IO_L55P_M3A13_3) RAM.L8(A13)
M3A14: FPGA.F5(B3:IO_L55N_M3A14_3) RAM.L3(RFU/A14)
M3BA0: FPGA.C3(B3:IO_L48P_M3BA0_3) RAM.G2(BA0)
M3BA1: FPGA.C2(B3:IO_L48N_M3BA1_3) RAM.G3(BA1)
M3BA2: FPGA.B1(B3:IO_L50N_M3BA2_3) RAM.G1(BA2)
M3CASN: FPGA.H5(B3:IO_L43N_GCLK22_IRDY2_M3CASN_3) RAM.G7(CAS#)
M3CKE: FPGA.F4(B3:IO_L53P_M3CKE_3) R28.2 RAM.F2(CKE)
M3CLK: FPGA.E2(B3:IO_L46P_M3CLK_3) RAM.E8(CK)
M3CLKN: FPGA.E1(B3:IO_L46N_M3CLKN_3) RAM.F8(CK#)
M3CSN: FPGA.M4(B3:IO_L1P_3) RAM.G8(CS#)
M3DQ0: FPGA.K2(B3:IO_L37P_M3DQ0_3) RAM.B1(DQ6)
M3DQ1: FPGA.K1(B3:IO_L37N_M3DQ1_3) RAM.B9(DQ7)
M3DQ2: FPGA.J3(B3:IO_L38P_M3DQ2_3) RAM.C2(DQ1)
M3DQ3: FPGA.J1(B3:IO_L38N_M3DQ3_3) RAM.C8(DQ0)
M3DQ4: FPGA.F2(B3:IO_L41P_GCLK27_M3DQ4_3) RAM.D7(DQ2)
M3DQ5: FPGA.F1(B3:IO_L41N_GCLK26_M3DQ5_3) RAM.D9(DQ5)
M3DQ6: FPGA.G3(B3:IO_L40P_M3DQ6_3) RAM.D1(DQ4)
M3DQ7: FPGA.G1(B3:IO_L40N_M3DQ7_3) RAM.D3(DQ3)
M3LDM: FPGA.J4(B3:IO_L42N_GCLK24_M3LDM_3) RAM.B3(DM/RDQS)
M3LDQS_N: FPGA.H1(B3:IO_L39N_M3LDQSN_3) RAM.A8(DQS#)
M3LDQS_P: FPGA.H2(B3:IO_L39P_M3LDQS_3) RAM.B7(DQS)
M3ODT: FPGA.L5(B3:IO_L45N_M3ODT_3) R26.2 RAM.F9(ODT)
M3RASN: FPGA.J6(B3:IO_L43P_GCLK23_M3RASN_3) RAM.F7(RAS#)
M3WEN: FPGA.C1(B3:IO_L50P_M3WE_3) RAM.F3(WE#)
MCO1_CLK: FPGA.J16(B1:IO_L43N_GCLK4_M1DQ5_1) ; also sheet 1
N$23: LVDS.P19(DETECT) R13.2
N$26: LVDS.P15(DDC_CLK) R17.1
N$27: LVDS.P16(DDC_DATA) R18.1
N$28: LVDS.P18(+5V) R19.1
N$65: A/V.RING1(R) C34.C(-)
N$66: A/V.TIP(L) C35.C(-)
N$77: C14.2 C35.A(+) R16.2
N$78: C15.2 C34.A(+) R50.2
N$79: A/V.SLEEVE(VID) C16.2 R51.2 R56.1
N$80: R52.2 R56.2 R57.1
N$81: R53.2 R57.2 R58.1
N$82: R54.2 R58.2 R59.1
N$83: R55.2 R59.2 R60.2
TMDS_CLKN: FPGA.T4(B2:IO_L63N_2) LVDS.P12(TMDS_CLKN)
TMDS_CLKP: FPGA.P4(B2:IO_L63P_2) LVDS.P10(TMDS_CLKP)
TMDS_D0N: FPGA.T5(B2:IO_L48N_RDWR_B_VREF_2) LVDS.P9(TMDS_D0N)
TMDS_D0P: FPGA.R5(B2:IO_L48P_D7_2) LVDS.P7(TMDS_D0P)
TMDS_D1N: FPGA.T7(B2:IO_L32N_GCLK28_2) LVDS.P6(TMDS_D1N)
TMDS_D1P: FPGA.R7(B2:IO_L32P_GCLK29_2) LVDS.P4(TMDS_D1P)
TMDS_D2N: FPGA.T9(B2:IO_L23N_2) LVDS.P3(TMDS_D2N)
TMDS_D2P: FPGA.R9(B2:IO_L23P_2) LVDS.P1(TMDS_D2P)
VIDEO_D0: FPGA.P12(B2:IO_L12N_D2_MISO3_2) R55.1
VIDEO_D1: FPGA.N9(B2:IO_L14P_D11_2) R54.1
VIDEO_D2: FPGA.P11(B2:IO_L13N_D10_2) R53.1
VIDEO_D3: FPGA.P9(B2:IO_L14N_D12_2) R52.1
VIDEO_D4: FPGA.T10(B2:IO_L3N_MOSI_CSI_B_MISO0_2) R51.1
Unconnected: A/V.TIP-SWITCH(SW) FPGA.B3(B3:IO_L83P_3) FPGA.B10(B0:IO_L35P_GCLK17_0) FPGA.D11(B0:IO_L66P_SCP1_0) FPGA.E4(B3:IO_L54P_M3RESET_3) FPGA.E6(B0:IO_L5N_0) FPGA.E7(B0:IO_L36P_GCLK15_0) FPGA.E8(B0:IO_L36N_GCLK14_0) FPGA.E10(B0:IO_L37P_GCLK13_0) FPGA.E11(B0:IO_L64N_SCP4_0) FPGA.E12(B1:IO_L1N_A24_VREF_1) FPGA.E13(B1:IO_L1P_A25_1) FPGA.F7(B0:IO_L5P_0) FPGA.F9(B0:IO_L40P_0) FPGA.F10(B0:IO_L64P_SCP5_0) FPGA.F12(B1:IO_L30P_A21_M1RESET_1) FPGA.F13(B1:IO_L32P_A17_M1A8_1) FPGA.G11(B1:IO_L30N_A20_M1A11_1) FPGA.G12(B1:IO_L38P_A5_M1CLK_1) FPGA.H11(B1:IO_L38N_A4_M1CLKN_1) FPGA.J11(B1:IO_L40P_GCLK11_M1A5_1) FPGA.J12(B1:IO_L40N_GCLK10_M1A6_1) FPGA.J13(B1:IO_L41P_GCLK9_IRDY1_M1RASN_1) FPGA.J14(B1:IO_L43P_GCLK5_M1DQ4_1) FPGA.K3(B3:IO_L42P_GCLK25_TRDY2_M3UDM_3) FPGA.K11(B1:IO_L42N_GCLK6_TRDY1_M1LDM_1) FPGA.K12(B1:IO_L42P_GCLK7_M1UDM_1) FPGA.L1(B3:IO_L36N_M3DQ9_3) FPGA.L3(B3:IO_L36P_M3DQ8_3) FPGA.L7(B2:IO_L62N_D6_2) FPGA.L8(B2:IO_L62P_D5_2) FPGA.L10(B2:IO_L16P_2) FPGA.L11(B2:CMPCS_B_2) FPGA.L12(B1:IO_L53P_1) FPGA.L13(B1:IO_L53N_VREF_1) FPGA.M1(B3:IO_L35N_M3DQ11_3) FPGA.M2(B3:IO_L35P_M3DQ10_3) FPGA.M5(B3:IO_L2P_3) FPGA.M6(B2:IO_L64P_D8_2) FPGA.M7(B2:IO_L31N_GCLK30_D15_2) FPGA.M9(B2:IO_L29P_GCLK3_2) FPGA.M10(B2:IO_L16N_VREF_2) FPGA.M11(B2:IO_L2N_CMPMOSI_2) FPGA.M13(B1:IO_L74P_AWAKE_1) FPGA.N1(B3:IO_L34N_M3UDQSN_3) FPGA.N3(B3:IO_L34P_M3UDQS_3) FPGA.N4(B3:IO_L2N_3) FPGA.N5(B2:IO_L49P_D3_2) FPGA.N6(B2:IO_L64N_D9_2) FPGA.N8(B2:IO_L29N_GCLK2_2) FPGA.P1(B3:IO_L33N_M3DQ13_3) FPGA.P2(B3:IO_L33P_M3DQ12_3) FPGA.P5(B2:IO_L49N_D4_2) FPGA.P6(B2:IO_L47P_2) FPGA.P7(B2:IO_L31P_GCLK31_D14_2) FPGA.P8(B2:IO_L30P_GCLK1_D13_2) FPGA.R1(B3:IO_L32N_M3DQ15_3) FPGA.R2(B3:IO_L32P_M3DQ14_3) FPGA.R12(B1:IO_L52P_M1DQ14_1) FPGA.T3(B2:IO_L65N_CSO_B_2) FPGA.T6(B2:IO_L47N_2) FPGA.T8(B2:IO_L30N_GCLK0_USERCCLK_2) FPGA.T12(B1:IO_L52N_M1DQ15_1) FPGA.T13(B1:IO_L51N_M1DQ13_1) LVDS.P13(CEC) LVDS.P14(RES) RAM.A2(RDQS#) RAM.L7(RFU/A15)

### Notes on the sheet
- Any of the data bits
  can be swapped
- Match byte lane
  to within 0.5mm
- Match CK and CK#
  within 0.254mm
- Match DQS and DQS#
  within 0.254mm

## Library data of the parts
A/V = reclone-rise:AV-JACK-4COND; DIGIKEY#: CP-43516SJCT-ND; MANF: CUI Devices; MANF#: SJ-43516-SMT-TR
ACTIVITY = SparkFun-LED:LED: LEDs Standard schematic elements and footprints for 5mm, 3mm, 1206, and 0603 sized LEDs. 5mm - Spark Fun Electronics SKU : COM-00529 (and others); DIGIKEY#: 732-4978-1-ND; MANF: Wurth Electronics Inc.; MANF#: 150060RS75000
ANTENNA = reclone-rise:ANTENNA_MEANDER_2.4GHZ
BAT = SparkFun-Electromechanical:BATTERY: Battery Holders Various common sizes : AA, AAA, 18650 (PRT-12895), 20mm coin cell and 12mm coin cell. 20MM_4LEGS, BATT-10373; DIGIKEY#: 36-3000-ND; MANF: Keystone Electronics; MANF#: 3000; PROD_ID: BATT-08044
BUSPWR = reclone-rise:M1X02; DIGIKEY#: S1112EC-02-ND; MANF: Sullins Connector Solutions; MANF#: PREC002SBAN-M71RC
C1 C9-C11 C34 C35 = SparkFun-Passives:CAP_POL: Capacitor Polarized These are standard SMD and PTH capacitors. Normally 10uF, 47uF, and 100uF in electrolytic and tantalum varieties. Always verify the external diameter of the through hole cap, it varies with capacity, voltage, and manufacturer. The EIA devices should be standard.; DIGIKEY#: 1276-1782-1-ND; MANF: Samsung Electro-Mechanics; MANF#: CL31A107MQHNNNE
C2 C7 C8 C12 C17-C20 C23-C25 C36-C38 C45 C46 C54 = SparkFun-Passives:CAP: Capacitor Standard 0603 ceramic capacitor, and 0.1" leaded capacitor.; DIGIKEY#: 1276-1044-1-ND; MANF: Samsung Electro-Mechanics; MANF#: CL10A475KP8NNNC
C3-C6 C26 C28-C31 C33 C39 C42-C44 C47-C50 = SparkFun-Passives:CAP: Capacitor Standard 0603 ceramic capacitor, and 0.1" leaded capacitor.; DIGIKEY#: 1276-2082-1-ND; MANF: Samsung Electro-Mechanics; MANF#: CL10B474KA8NFNC
C13-C15 C27 = SparkFun-Passives:CAP: Capacitor Standard 0603 ceramic capacitor, and 0.1" leaded capacitor.; DIGIKEY#: 1276-1063-1-ND; MANF: Samsung Electro-Mechanics; MANF#: CL10B473KB8NNNC
C16 C21 C22 C51 = SparkFun-Passives:CAP: Capacitor Standard 0603 ceramic capacitor, and 0.1" leaded capacitor.; DIGIKEY#: 399-9053-1-ND; MANF: KEMET; MANF#: C0603C270J3GACTU
C58 C59 = SparkFun-Passives:CAP: Capacitor Standard 0603 ceramic capacitor, and 0.1" leaded capacitor.; DIGIKEY#: 478-10289-1-ND; MANF: AVX Corporation; MANF#: 06035A150FAT2A
CASCADE = SparkFun-Connectors:M03: Header 3 Standard 3-pin 0.1" header. Use with straight break away headers (SKU : PRT-00116), right angle break away headers (PRT-00553), swiss pins (PRT-00743), machine pins (PRT-00117), and female headers (PRT-00115). Molex polarized connector foot print use with SKU : PRT-08232 with associated crimp pins and housings.
DEVICE = reclone-rise:USB-MICRO-B-SMD; DIGIKEY#: 609-4618-1-ND; MANF: FCI; MANF#: 10118194-0001LF
DFU RESET = reclone-rise:PTS636; DIGIKEY#: CKN12301-ND; MANF: C&K; MANF#: PTS636 SL43 LFS
FPGA = reclone-rise:XC6SLX16FTG256; DIGIKEY#: 122-1672-ND; MANF: Xilinx Inc.; MANF#: XC6SLX16-2FTG256C
FUSE = reclone-rise:POLYFUSE; DIGIKEY#: MF-NSMF150-2CT-ND; MANF: Bourns Inc.; MANF#: MF-NSMF150-2
GPIO = reclone-rise:M2X20; DIGIKEY#: S2012EC-20-ND; MANF: Sullins Connector Solutions; MANF#: PREC020DAAN-RC
HOST = reclone-rise:USB_A_1H; DIGIKEY#: 609-87520-0012BLF-ND; MANF: Amphenol ICC (FCI); MANF#: 87520-0012BLF
JTAG-FPGA = reclone-rise:XILINX-JTAG; DIGIKEY#: WM18641-ND; MANF: Molex; MANF#: 0878321420
JTAG-MCU = reclone-rise:STDC14; DIGIKEY#: 1175-1630-ND; MANF: CNC Tech; MANF#: 3220-14-0100-00
L1 = SparkFun-Passives:INDUCTOR: Inductors Basic Inductor/Choke - 0603 and 1206. Footprints are not proven and vary greatly between part numbers. INDUCTOR POWER 3.3UH 4.0A SMD 0.197" L x 0.197" W x 0.177" H (5.00mm x 5.00mm x 4.50mm); DIGIKEY#: 490-13960-1-ND; MANF: Murata Electronics; MANF#: BLM18SN220TZ1D
L4-L6 = SparkFun-Passives:INDUCTOR: Inductors Basic Inductor/Choke - 0603 and 1206. Footprints are not proven and vary greatly between part numbers. INDUCTOR POWER 3.3UH 4.0A SMD 0.197" L x 0.197" W x 0.177" H (5.00mm x 5.00mm x 4.50mm); DIGIKEY#: 1276-6911-1-ND; MANF: Samsung Electro-Mechanics; MANF#: CIGT201610LH2R2MNE
LVDS = reclone-rise:TMDS_A; DIGIKEY#: 609-4614-1-ND; MANF: FCI; MANF#: 10029449-111RLF
MCU = reclone-rise:STM32F405VGT6; DIGIKEY#: 497-11910-ND; MANF: STMicroelectronics; MANF#: STM32F405VGT6
MICROSD = reclone-rise:MICROSD_PUSHPULL; DIGIKEY#: WM14405CT-ND; MANF: Molex; MANF#: 1051620001
OSC10M = reclone-rise:OSC_ENABLED_SMD; DIGIKEY#: 631-1436-1-ND; MANF: Fox Electronics; MANF#: F535L-10
PIXEL = adafruit:WS2812B; DIGIKEY#: 1568-COM-16347CT-ND; MANF: SparkFun Electronics; MANF#: COM-16347
PWRSW = reclone-rise:AP2171D; DIGIKEY#: AP2171DWG-7DICT-ND; MANF: Diodes Incorporated; MANF#: AP2171DWG-7
R1 R2 R13 R20 R26-R30 R35 R36 = SparkFun-Passives:RESISTOR: Resistor Basic schematic elements and footprints for 0603, 1206, and PTH resistors.; DIGIKEY#: 311-4.70KHRCT-ND; MANF: Yageo; MANF#: RC0603FR-074K7L
R3 R16 R50 R56-R59 = SparkFun-Passives:RESISTOR: Resistor Basic schematic elements and footprints for 0603, 1206, and PTH resistors.; DIGIKEY#: 311-165HRCT-ND; MANF: Yageo; MANF#: RC0603FR-07165RL
R10 R14 R22 R31-R33 R41-R48 = SparkFun-Passives:RESISTOR: Resistor Basic schematic elements and footprints for 0603, 1206, and PTH resistors.; DIGIKEY#: 311-47.0KHRCT-ND; MANF: Yageo; MANF#: RC0603FR-0747KL
R17 R18 R61 R62 = SparkFun-Passives:RESISTOR: Resistor Basic schematic elements and footprints for 0603, 1206, and PTH resistors.; DIGIKEY#: 311-2.20KHRCT-ND; MANF: Yageo; MANF#: RC0603FR-072K2L
R19 R37-R40 = SparkFun-Passives:RESISTOR: Resistor Basic schematic elements and footprints for 0603, 1206, and PTH resistors.; DIGIKEY#: 311-22.0HRCT-ND; MANF: Yageo; MANF#: RC0603FR-0722RL
R34 = SparkFun-Passives:RESISTOR: Resistor Basic schematic elements and footprints for 0603, 1206, and PTH resistors.; DIGIKEY#: 311-0.0GRCT-ND; MANF: Yageo; MANF#: RC0603JR-070RL
R49 = SparkFun-Passives:RESISTOR: Resistor Basic schematic elements and footprints for 0603, 1206, and PTH resistors.; DIGIKEY#: 311-115KHRCT-ND; MANF: Yageo; MANF#: RC0603FR-07115KL
R51-R55 R60 = SparkFun-Passives:RESISTOR: Resistor Basic schematic elements and footprints for 0603, 1206, and PTH resistors.; DIGIKEY#: 311-330HRCT-ND; MANF: Yageo; MANF#: RC0603FR-07330RL
R63 = SparkFun-Passives:RESISTOR: Resistor Basic schematic elements and footprints for 0603, 1206, and PTH resistors.; DIGIKEY#: 311-25.5KHRCT-ND; MANF: Yageo; MANF#: RC0603FR-0725K5L
R64 = SparkFun-Passives:RESISTOR: Resistor Basic schematic elements and footprints for 0603, 1206, and PTH resistors.; DIGIKEY#: 311-75.0KHRCT-ND; MANF: Yageo; MANF#: RC0603FR-0775KL
R65 = SparkFun-Passives:RESISTOR: Resistor Basic schematic elements and footprints for 0603, 1206, and PTH resistors.; DIGIKEY#: 311-150KHRCT-ND; MANF: Yageo; MANF#: RC0603FR-07150KL
R66 = SparkFun-Passives:RESISTOR: Resistor Basic schematic elements and footprints for 0603, 1206, and PTH resistors.; DIGIKEY#: 311-34.0KHRCT-ND; MANF: Yageo; MANF#: RC0603FR-0734KL
R67 = SparkFun-Passives:RESISTOR: Resistor Basic schematic elements and footprints for 0603, 1206, and PTH resistors.; DIGIKEY#: 311-35.7KHRCT-ND; MANF: Yageo; MANF#: RC0603FR-0735K7L
RAM = reclone-rise:DDR2_X8; DIGIKEY#: 706-1574-ND; MANF: ISSI Integrated Silicon Solution Inc; MANF#: IS43DR81280C-25DBL
RTC = reclone-rise:CRYSTAL; DIGIKEY#: 370-1056-1-ND; MANF: Cardinal Components Inc.; MANF#: CPFBZ-A2C4-32.768KD12.5
USER = reclone-rise:SPST_TACT_6X6; DIGIKEY#: 450-1649-ND; MANF: TE Connectivity ALCOSWITCH Switches; MANF#: 1825910-2
VREG12 VREG18 VREG33 = reclone-rise:AP3429A; DIGIKEY#: AP3429AKTTR-G1DICT-ND; MANF: Diodes Incorporated; MANF#: AP3429AKTTR-G1
WIFI/BT = reclone-rise:RL-SM02BD-RTL8723BS; MANF: Realtek; MANF#: RL-SM02BD-8723BS-V1.3

## Net classes
0 default: width 0.152 mm, drill 0.305 mm